# Altium schematic sheet HYDRA_V4_POWER.SchDoc
size A2; SheetNumber: 1; SheetTotal: 11
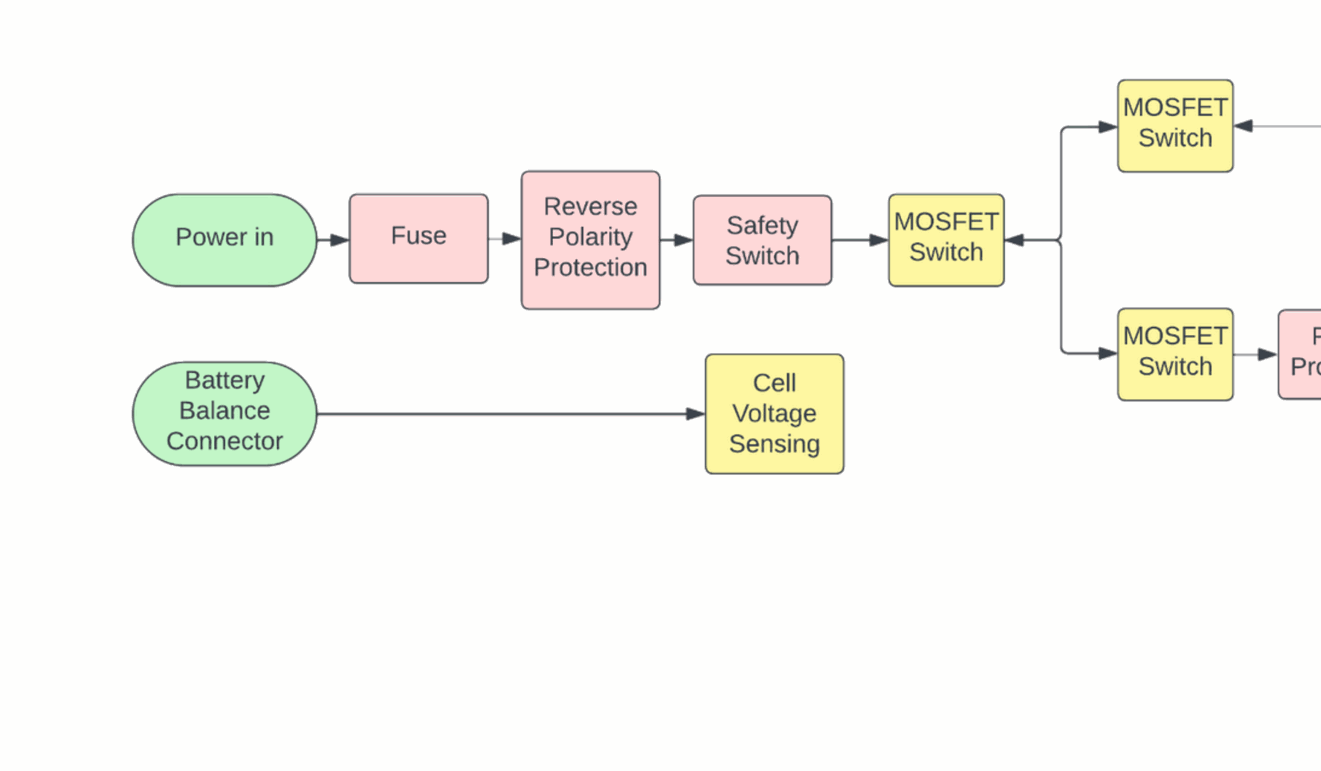
[diagram p0: HYDRA_V4_POWER.SchDoc, top left]
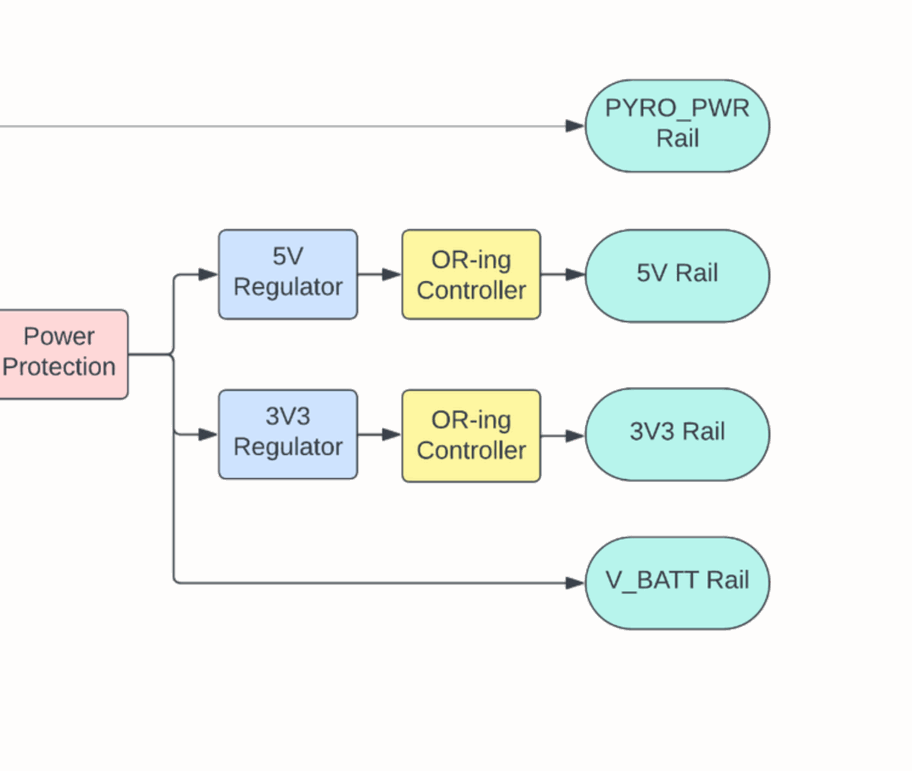
[diagram p1: HYDRA_V4_POWER.SchDoc, top right]
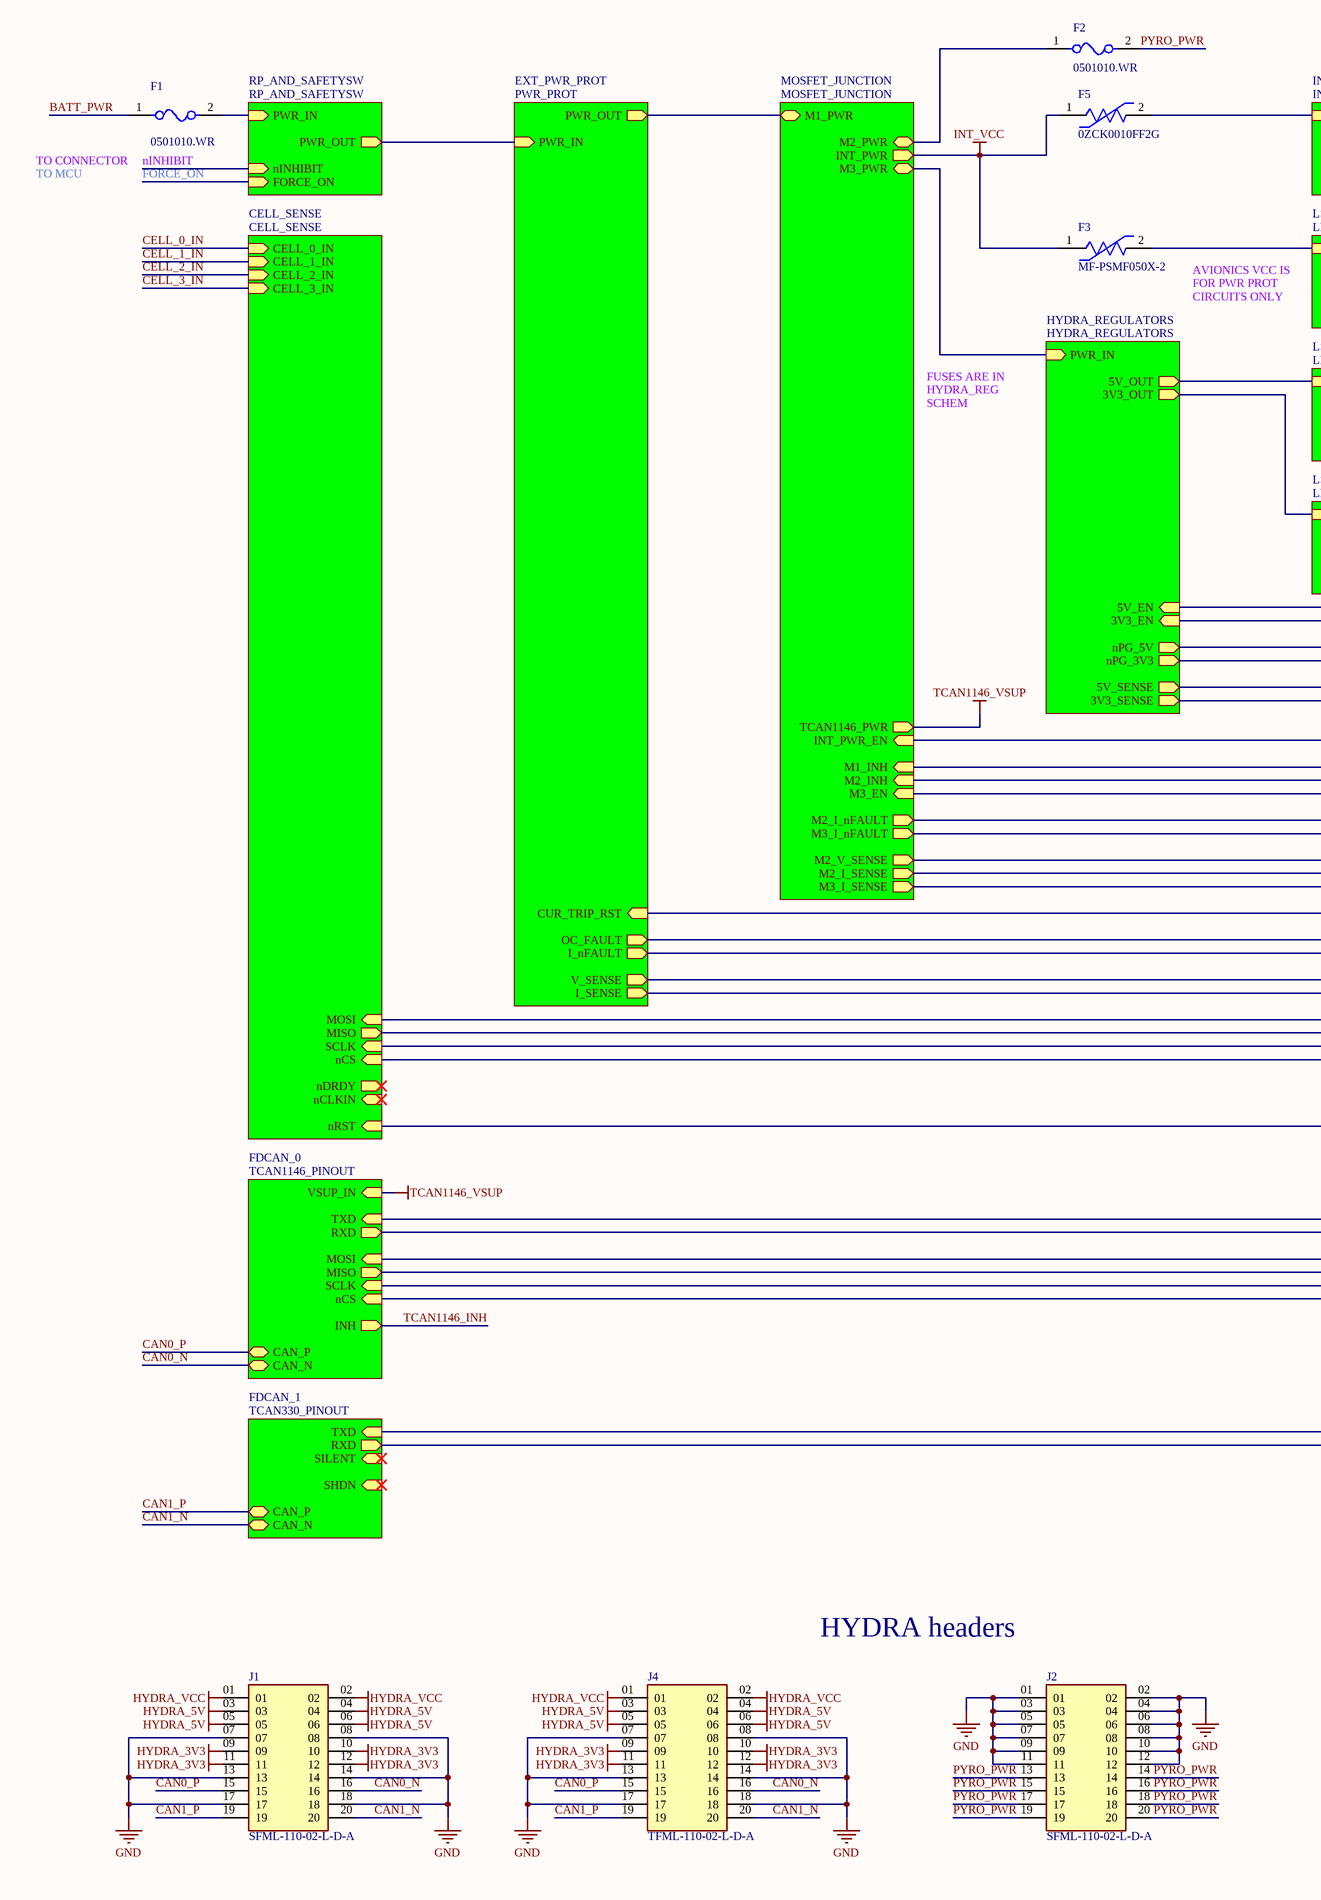
[diagram p2: HYDRA_V4_POWER.SchDoc, bottom left]
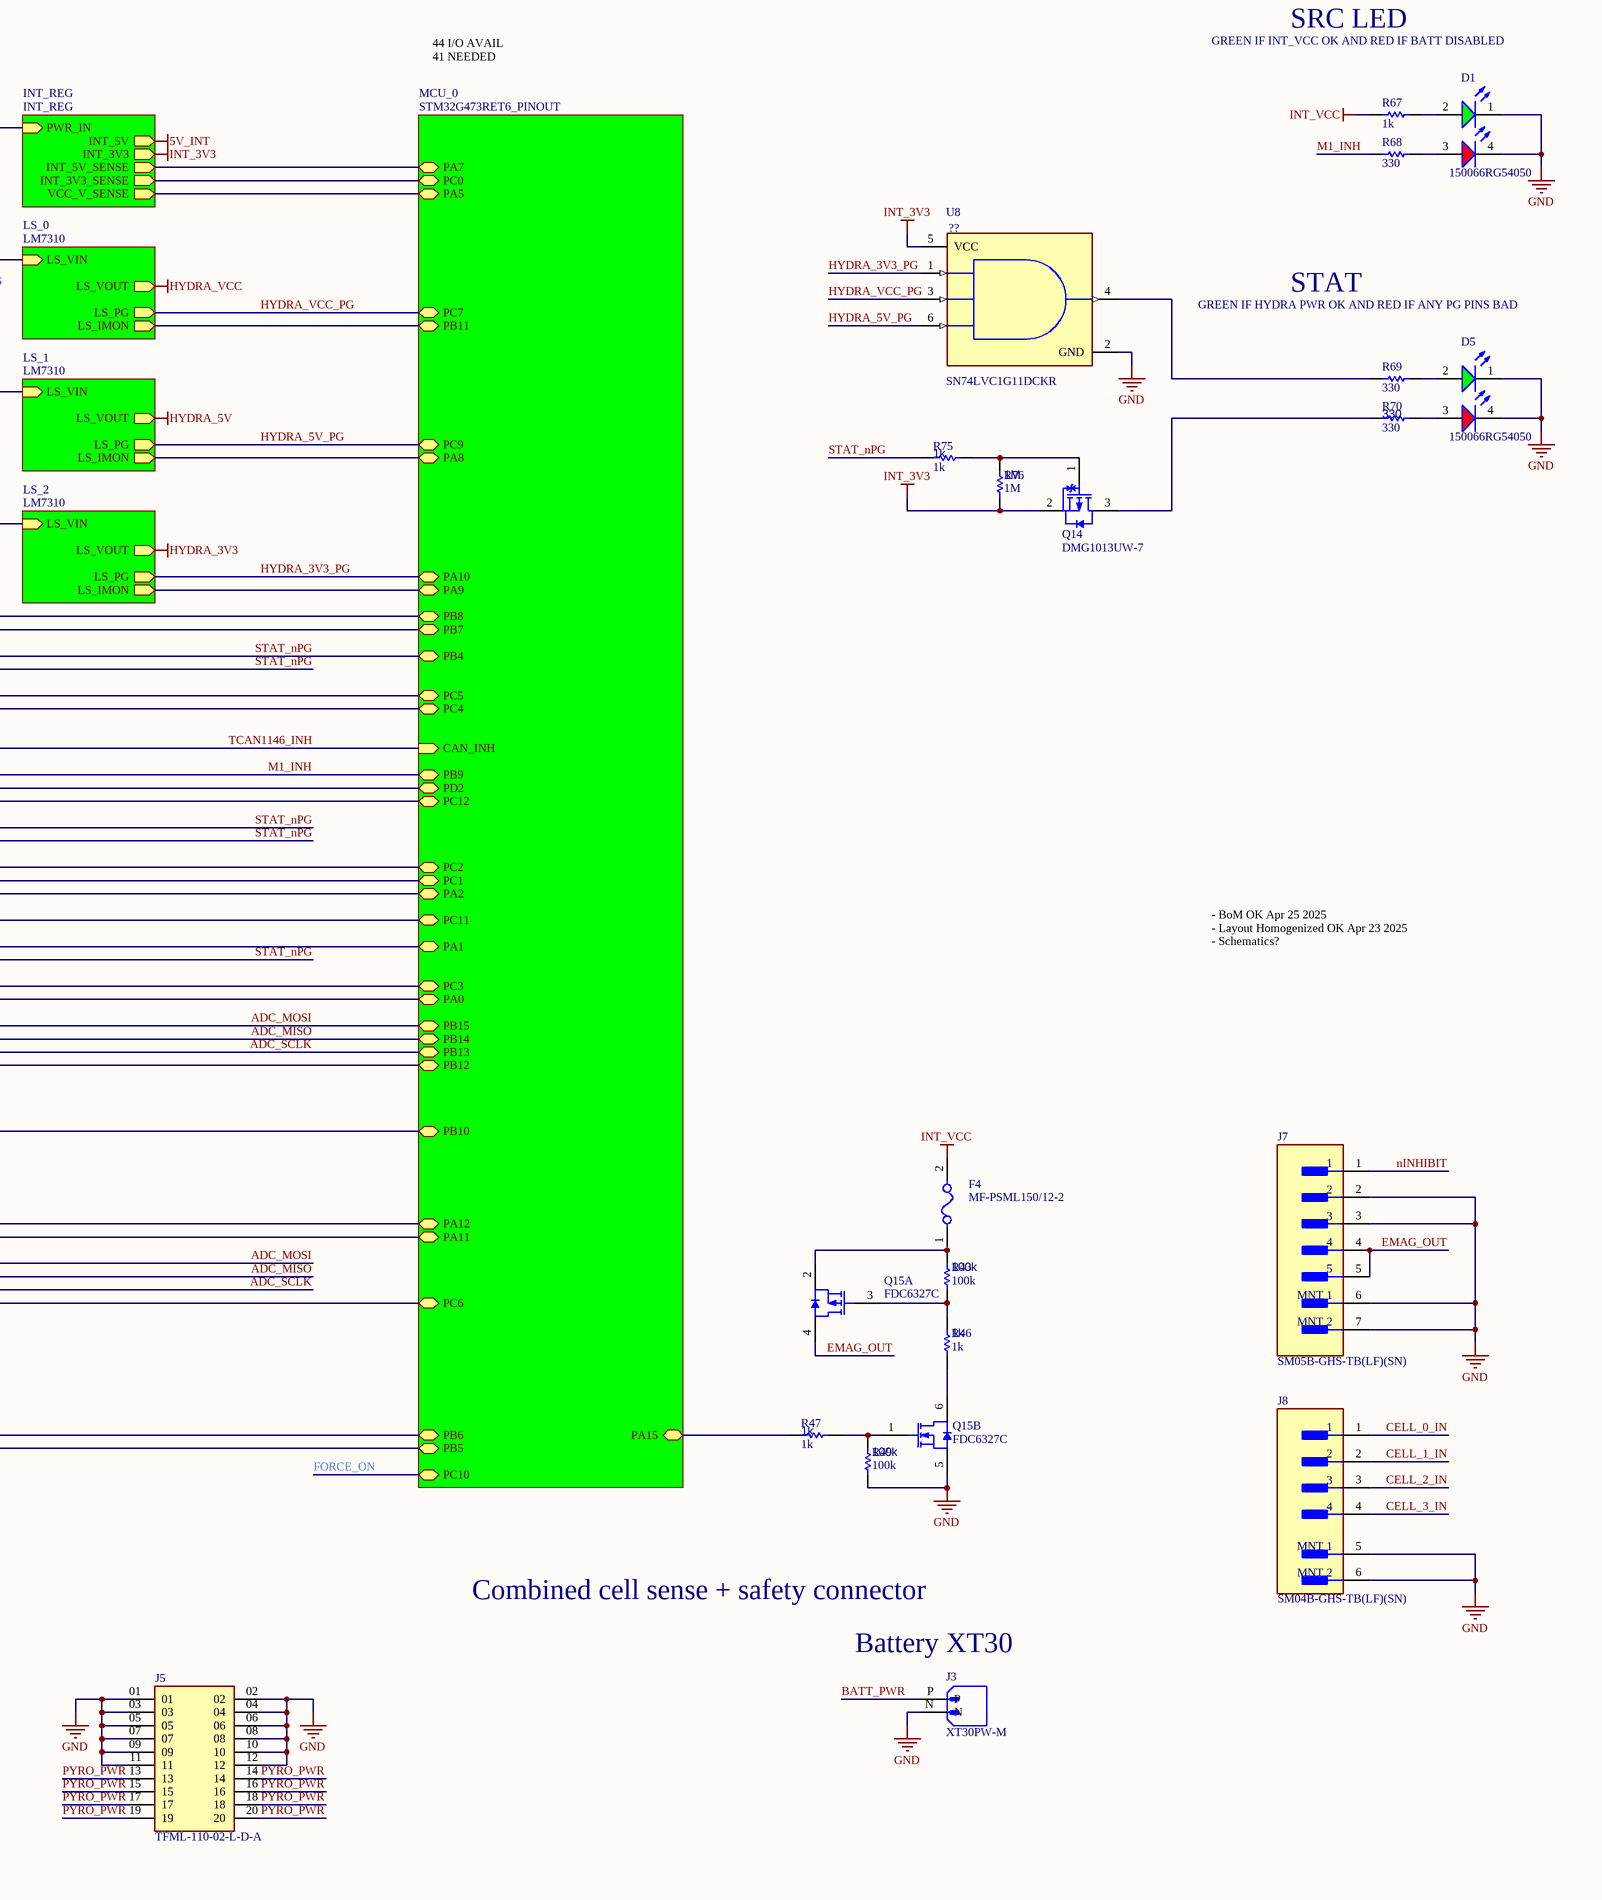
[diagram p3: HYDRA_V4_POWER.SchDoc, bottom right]

## Parts
D1  150066RG54050  [WL-SBCD_0606]
D5  150066RG54050  [WL-SBCD_0606]
F1  0501010.WR  [FP-0501-MFG]
F2  0501010.WR  [FP-0501-MFG]
F3  MF-PSMF050X-2  [FP-MF-PSMF-MFG]
F4  MF-PSML150/12-2  [FP-0805L010-MFG]
F5  0ZCK0010FF2G  [FP-0ZCK0010FF2G-MFG]
J1  SFML-110-02-L-D-A  [SFML-110-02-L-D-A-Footprint-1]
J2  SFML-110-02-L-D-A  [SFML-110-02-L-D-A-Footprint-1]
J3  XT30PW-M  [XT30PW-M-Footprint-1]
J4  TFML-110-02-L-D-A  [TFML-110-02-L-D-A-Footprint-1]
J5  TFML-110-02-L-D-A  [TFML-110-02-L-D-A-Footprint-1]
J7  SM05B-GHS-TB(LF)(SN)  [FP-SM05B-GHS-TB_LF_SN-MFG]
J8  SM04B-GHS-TB(LF)(SN)  [FP-SM04B-GHS-TB_LF_SN-MFG]
Q14  DMG1013UW-7  [DIOD-SOT323-3_V]
Q15  FDC6327C  [FAIR-SOT23-6_V]  (parts A,B of 2)
R43  100k  [R0603B]
R46  1k  [R0603B]
R47  1k  [R0603B]
R49  100k  [R0603B]
R67  1k  [R0603B]
R68  330  [R0603B]
R69  330  [R0603B]
R70  330  [R0603B]
R75  1k  [R0603B]
R76  1M  [R0603B]
U8  SN74LVC1G11DCKR  [FP-DCK0006A-MFG]  (value not drawn)

## Sub-sheets
CELL_SENSE = CELL_SENSE: CELL_0_IN (in), CELL_1_IN (in), CELL_2_IN (in), CELL_3_IN (in), MOSI (in), MISO (out), SCLK (in), nCS (in), nRST (in), nDRDY (out), nCLKIN (in)
EXT_PWR_PROT = PWR_PROT: PWR_IN (in), PWR_OUT (out), V_SENSE (out), I_SENSE (out), CUR_TRIP_RST (in), OC_FAULT (out), I_nFAULT (out)
FDCAN_0 = TCAN1146_PINOUT: TXD (in), RXD (out), MOSI (in), MISO (out), SCLK (in), nCS (in), INH (out), CAN_P (bidir), CAN_N (bidir), VSUP_IN (in)
FDCAN_1 = TCAN330_PINOUT: TXD (in), RXD (out), SHDN (in), SILENT (in), CAN_P (bidir), CAN_N (bidir)
HYDRA_REGULATORS = HYDRA_REGULATORS: PWR_IN (in), 5V_OUT (out), 3V3_OUT (out), 5V_SENSE (out), 3V3_SENSE (out), 5V_EN (in), 3V3_EN (in), nPG_3V3 (out), nPG_5V (out)
INT_REG = INT_REG: PWR_IN (in), INT_3V3 (out), INT_3V3_SENSE (out), VCC_V_SENSE (out), INT_5V (out), INT_5V_SENSE (out)
LS_0 = LM7310: LS_VIN (in), LS_VOUT (out), LS_PG (out), LS_IMON (out)
LS_1 = LM7310: LS_VIN (in), LS_VOUT (out), LS_PG (out), LS_IMON (out)
LS_2 = LM7310: LS_VIN (in), LS_VOUT (out), LS_PG (out), LS_IMON (out)
MCU_0 = STM32G473RET6_PINOUT: CAN_INH (in), PB12 (bidir), PB13 (bidir), PB14 (bidir), PB15 (bidir), PA11 (bidir), PA12 (bidir), PB5 (bidir), PB6 (bidir), PC7 (bidir), PB11 (bidir), PC9 (bidir), PA8 (bidir), PA9 (bidir), PA10 (bidir), PC6 (bidir), PA5 (bidir), PC0 (bidir), PB7 (bidir), PB8 (bidir), PB4 (bidir), PC5 (bidir), PC4 (bidir), PB9 (bidir), PD2 (bidir), PC12 (bidir), PC3 (bidir), PC2 (bidir), PA1 (bidir), PC1 (bidir), PA0 (bidir), PB10 (bidir), PC11 (bidir), PA2 (bidir), PA15 (bidir), PC10 (bidir), PA7 (bidir)
MOSFET_JUNCTION = MOSFET_JUNCTION: M1_PWR (bidir), M2_PWR (bidir), M3_PWR (bidir), INT_PWR (out), M2_I_SENSE (out), M3_I_SENSE (out), M2_INH (in), M1_INH (in), M3_EN (in), INT_PWR_EN (in), TCAN1146_PWR (out), M2_V_SENSE (out), M2_I_nFAULT (out), M3_I_nFAULT (out)
RP_AND_SAFETYSW = RP_AND_SAFETYSW: PWR_IN (in), PWR_OUT (out), nINHIBIT (in), FORCE_ON (in)

## Nets
5V_INT: sheet INT_REG/INT_5V
GND: D1.1(K) D1.4(K) D5.1(K) D5.4(K) J1.07 J1.08 J1.13 J1.14 J1.17 J1.18 J2.01 J2.02 J2.03 J2.04 J2.05 J2.06 J2.07 J2.08 J2.09 J2.10 J2.11 J2.12 J3.N J4.07 J4.08 J4.13 J4.14 J4.17 J4.18 J5.01 J5.02 J5.03 J5.04 J5.05 J5.06 J5.07 J5.08 J5.09 J5.10 J5.11 J5.12 J7.2 J7.3 J7.6(MNT_1) J7.7(MNT_2) J8.5(MNT_1) J8.6(MNT_2) Q15.5(S) R49.2 U8.2(GND)
HYDRA_3V3: J1.09 J1.10 J1.11 J1.12 J4.09 J4.10 J4.11 J4.12 ; sheet LS_2/LS_VOUT
HYDRA_5V: J1.03 J1.04 J1.05 J1.06 J4.03 J4.04 J4.05 J4.06 ; sheet LS_1/LS_VOUT
HYDRA_VCC: J1.01 J1.02 J4.01 J4.02 ; sheet LS_0/LS_VOUT
INT_3V3: Q14.2(S) R76.2 U8.5(VCC) ; sheet INT_REG/INT_3V3
INT_VCC: F3.1 F4.2 F5.1 R67.2 ; sheet MOSFET_JUNCTION/INT_PWR
TCAN1146_VSUP: sheet MOSFET_JUNCTION/TCAN1146_PWR, sheet FDCAN_0/VSUP_IN
ADC_MISO: sheet MCU_0/PB14, sheet CELL_SENSE/MISO, sheet FDCAN_0/MISO
ADC_MOSI: sheet MCU_0/PB15, sheet CELL_SENSE/MOSI, sheet FDCAN_0/MOSI
ADC_SCLK: sheet MCU_0/PB13, sheet CELL_SENSE/SCLK, sheet FDCAN_0/SCLK
BATT_PWR: F1.1 J3.P
CAN0_N: J1.16 J4.16 ; sheet FDCAN_0/CAN_N
CAN0_P: J1.15 J4.15 ; sheet FDCAN_0/CAN_P
CAN1_N: J1.20 J4.20 ; sheet FDCAN_1/CAN_N
CAN1_P: J1.19 J4.19 ; sheet FDCAN_1/CAN_P
CELL_0_IN: J8.1 ; sheet CELL_SENSE/CELL_0_IN
CELL_1_IN: J8.2 ; sheet CELL_SENSE/CELL_1_IN
CELL_2_IN: J8.3 ; sheet CELL_SENSE/CELL_2_IN
CELL_3_IN: J8.4 ; sheet CELL_SENSE/CELL_3_IN
EMAG_OUT: J7.4 J7.5 Q15.4(D)
FORCE_ON: sheet MCU_0/PC10, sheet RP_AND_SAFETYSW/FORCE_ON
HYDRA_3V3_PG: U8.1(A) ; sheet MCU_0/PA10, sheet LS_2/LS_PG
HYDRA_5V_PG: U8.6(C) ; sheet MCU_0/PC9, sheet LS_1/LS_PG
HYDRA_VCC_PG: U8.3(B) ; sheet MCU_0/PC7, sheet LS_0/LS_PG
M1_INH: R68.2 ; sheet MCU_0/PB9, sheet MOSFET_JUNCTION/M1_INH
nINHIBIT: J7.1 ; sheet RP_AND_SAFETYSW/nINHIBIT
PYRO_PWR: F2.2 J2.13 J2.14 J2.15 J2.16 J2.17 J2.18 J2.19 J2.20 J5.13 J5.14 J5.15 J5.16 J5.17 J5.18 J5.19 J5.20
STAT_nPG: R75.2 ; sheet MCU_0/PB4, sheet EXT_PWR_PROT/I_nFAULT, sheet MOSFET_JUNCTION/M2_I_nFAULT, sheet MOSFET_JUNCTION/M3_I_nFAULT, sheet HYDRA_REGULATORS/nPG_3V3, sheet HYDRA_REGULATORS/nPG_5V
TCAN1146_INH: sheet MCU_0/CAN_INH, sheet MOSFET_JUNCTION/INT_PWR_EN, sheet FDCAN_0/INH
NetD1_2: D1.2(A) R67.1
NetD1_3: D1.3(A) R68.1
NetD5_2: D5.2(A) R69.1
NetD5_3: D5.3(A) R70.1
NetF1_2: F1.2 ; sheet RP_AND_SAFETYSW/PWR_IN
NetF2_1: F2.1 ; sheet MOSFET_JUNCTION/M2_PWR
NetF3_2: F3.2 ; sheet LS_0/LS_VIN
NetF4_1: F4.1 Q15.2(S) R43.2
NetF5_2: F5.2 ; sheet INT_REG/PWR_IN
NetQ14_1: Q14.1(G) R75.1 R76.1
NetQ14_3: Q14.3(D) R70.2
NetQ15_1: Q15.1(G) R47.1 R49.1
NetQ15_3: Q15.3(G) R43.1 R46.1
NetQ15_6: Q15.6(D) R46.2
NetR47_2: R47.2 ; sheet MCU_0/PA15
NetR69_2: R69.2 U8.4(Y)
(unnamed): sheet MCU_0/PB12, sheet CELL_SENSE/nCS
(unnamed): sheet MCU_0/PA11, sheet FDCAN_0/RXD
(unnamed): sheet MCU_0/PA12, sheet FDCAN_0/TXD
(unnamed): sheet MCU_0/PB5, sheet FDCAN_1/RXD
(unnamed): sheet MCU_0/PB6, sheet FDCAN_1/TXD
(unnamed): sheet MCU_0/PB11, sheet LS_0/LS_IMON
(unnamed): sheet MCU_0/PA8, sheet LS_1/LS_IMON
(unnamed): sheet MCU_0/PA9, sheet LS_2/LS_IMON
(unnamed): sheet MCU_0/PC6, sheet FDCAN_0/nCS
(unnamed): sheet MCU_0/PA5, sheet INT_REG/VCC_V_SENSE
(unnamed): sheet MCU_0/PC0, sheet INT_REG/INT_3V3_SENSE
(unnamed): sheet MCU_0/PB7, sheet HYDRA_REGULATORS/3V3_EN
(unnamed): sheet MCU_0/PB8, sheet HYDRA_REGULATORS/5V_EN
(unnamed): sheet MCU_0/PC5, sheet HYDRA_REGULATORS/5V_SENSE
(unnamed): sheet MCU_0/PC4, sheet HYDRA_REGULATORS/3V3_SENSE
(unnamed): sheet MCU_0/PD2, sheet MOSFET_JUNCTION/M2_INH
(unnamed): sheet MCU_0/PC12, sheet MOSFET_JUNCTION/M3_EN
(unnamed): sheet MCU_0/PC3, sheet EXT_PWR_PROT/V_SENSE
(unnamed): sheet MCU_0/PC2, sheet MOSFET_JUNCTION/M2_V_SENSE
(unnamed): sheet MCU_0/PA1, sheet EXT_PWR_PROT/OC_FAULT
(unnamed): sheet MCU_0/PC1, sheet MOSFET_JUNCTION/M2_I_SENSE
(unnamed): sheet MCU_0/PA0, sheet EXT_PWR_PROT/I_SENSE
(unnamed): sheet MCU_0/PB10, sheet CELL_SENSE/nRST
(unnamed): sheet MCU_0/PC11, sheet EXT_PWR_PROT/CUR_TRIP_RST
(unnamed): sheet MCU_0/PA2, sheet MOSFET_JUNCTION/M3_I_SENSE
(unnamed): sheet MCU_0/PA7, sheet INT_REG/INT_5V_SENSE
(unnamed): sheet EXT_PWR_PROT/PWR_IN, sheet RP_AND_SAFETYSW/PWR_OUT
(unnamed): sheet EXT_PWR_PROT/PWR_OUT, sheet MOSFET_JUNCTION/M1_PWR
(unnamed): sheet MOSFET_JUNCTION/M3_PWR, sheet HYDRA_REGULATORS/PWR_IN
(unnamed): sheet HYDRA_REGULATORS/5V_OUT, sheet LS_1/LS_VIN
(unnamed): sheet HYDRA_REGULATORS/3V3_OUT, sheet LS_2/LS_VIN

## Notes on the sheet
- GREEN IF INT_VCC OK AND RED IF BATT DISABLED
- SRC LED
- 44 I/O AVAIL
  41 NEEDED
- TO MCU
- TO CONNECTOR
- AVIONICS VCC IS FOR PWR PROT CIRCUITS ONLY
- GREEN IF HYDRA PWR OK AND RED IF ANY PG PINS BAD
- STAT
- FUSES ARE IN HYDRA_REG SCHEM
- - BoM OK Apr 25 2025
  - Layout Homogenized OK Apr 23 2025
  - Schematics?
- HYDRA headers
- Combined cell sense + safety connector
- (near J3) Battery XT30
- (in symbol CMP-0859-00482-4) ??

## Library data of the parts
D1 D5 = CMP-004-00040-2: Led, Red/Grn, 180Mcd/230Mcd, 624Nm/525Nm Rohs Compliant: Yes; Source: rgled.SchLib; Component Type: Standard; Design Item ID: CMP-004-00034-2; Pins: 4
F1 F2 = CMP-08605-000084-1: FUSE BOARD MOUNT 10A 32VDC 1206; Working Voltage: 32V; Approvals: UL; Fuse Type: Board Mount (Cartridge Style Excluded); DC Cold Resistance: 4.27mR; Depth: 1.63mm; Housing Material: Ceramic; Max Operating Temperature: 150°C; Voltage Rating (DC): 32V; Width: 1.63mm; Height: 0.033inch; Current Rating: 10A; Composition: Ceramic; Lead Free: Lead Free; Case Code (Metric): 3216; Min Operating Temperature: -55°C; Packaging: Tape and Reel; Mount: Surface Mount; Case/Package: 1206; Case Code (Imperial): 1206; Package Quantity: 3000; Length: 3.2mm
F3 = CMP-07400-000013-1: PTC RESET FUSE 6V 500MA 0805; Manufacturer: Bourns Inc.; Trip Current: 1A; Trip Time: 0.1s; Value: 0.15-0.9Ω; Hold Current: 0.5A; Current Rating: 40A; Category: Fuse; Temperature: -40°C to +85°C; ComponentLink2Description: Datasheet; Manufacturer Part Number: MF-PSMF050X-2; Temperature Range High: +85°C; Package: MF-PSMF; Device Class L1: Circuit Protection; Lead Free: Yes; ComponentLink2URL: https://www.bourns.com/docs/product-datasheets/mfpsmf.pdf?sfvrsn=9c05cafe_24; Ambient Temperature Range Low: -40°C; Mouser Description: Resettable Fuses - PPTC .50A 6V 0.15ohm Hold .5 Trip 1; Resistance: 0.15-0.9Ω; Automotive: Yes; Ambient Temperature Range High: +85°C; Device Class L2: PTC Resettable Fuses; Temperature Range Low: -40°C; Device Class L3: unset; Octopart: https://octopart.com/mf-psmf050x-2-bourns-7483438; Digikey Description: PTC RESET FUSE 6V 500MA 0805; Height: 0.85mm; RoHS: TRUE; Voltage Rating: 6V
F4 = CMP-00227-00673855-1: NexarPartId: 673855; Minimum Resistance Initial (Rmin): 1Ω; Maximum Resistance 1 Hour (R1max): 6Ω; Max Current Rating: 100A; Power Dissipation: 500mW; Working Voltage: 15V; Time to Trip: 1.5s; Hold Current: 100mA; Trip Current: 300mA; Approvals: TUV, cULus; Min Operating Temperature: -40°C; Case Code (Imperial): 0805; Termination: SMD/SMT; Height: 1mm; Resistance: 6Ω; Case Code (Metric): 2012; Lifecycle Status: Production; Operating Supply Voltage: 15V; Mount: Surface Mount; Voltage Rating: 15V; RoHS: Compliant; Width: 1.5mm; Length: 2.2mm; Voltage Rating (DC): 15V; Ambient Temperature Range High: 85°C; Max Power Dissipation: 500mW; Lead Free: Lead Free; Max Operating Temperature: 85°C; Current Rating: 100A; Terminal Material: Copper; Packaging: Cut Tape; REACH SVHC: No SVHC; Max Voltage Rating (DC): 15V; Case/Package: 0805
F5 = CMP-16043-000017-1: PTC RESET FUSE 15V 100MA 0805; Max Current Rating: 100A; Trip Current: 300mA; Time to Trip: 1.5s; Lead Free: Lead Free; Case/Package: 0805; Package Quantity: 1; Hold Current: 100mA; Case Code (Metric): 2012; Packaging: Tape and Reel; Case Code (Imperial): 0805; RoHS Compliant: Yes
J1 J2 = CMP-002-00043-1: Board Connector, 20 Contact(s), 2 Row(s), Female, Straight, 0.05 inch Pitch, Surface Mount Terminal, Locking, Black Insulator, Socket; RoHS Compliant: Yes; Connector Type: BOARD CONNECTOR; Mounting Technology: Board
J3 = CMP-002-00064-1
J4 J5 = CMP-002-00042-3: Board Connector, 20 Contact(s), 2 Row(s), Male, Straight, Surface Mount Terminal; Connector Type: BOARD CONNECTOR; Mounting Technology: Board; RoHS Compliant: Yes
J7 = CMP-002-00081-1: Connector Header, GH Series, 5 Position, 1.25mm, Surface Mount, Right Angle, Tin, Natural
J8 = CMP-002-00080-1: Conn Shrouded Header HDR 4 POS 1.25mm Solder RA SMD Reel
Q14 = CMP-2000-06170-1: P-Channel Enhancement Mode MOSFET, 310 mW, 20 V, -55 to 150 degC, 3-Pin SOT-323, RoHS, Tape and Reel; Manufacturer: Diodes Inc; Qg Gate Charge: 0.622nC; Drain-Source On Resistance-Max: 750mO; Rated Power Dissipation: 310mW; Drain-to-Source Voltage [Vdss]: 20V; Package Reference: SOT323; Datasheet Version: Rev. 3-2, 09/2013; Package Description: 3-Pin Small Outline Transistor, Body 2 x 1.25 mm, Pitch 0.65 mm; Mounting Technology: SurfaceMount; Manufacturer URL: http://www.diodes.com/; Datasheet URL: http://www.diodes.com/_files/datasheets/ds31861.pdf; Channel Type: P-Channel
Q15 = CMP-2000-04939-1: Dual N & P-Channel 2.5 V Specified PowerTrench(TM) MOSFET, -55 to 150 degC, 6-Pin SOT-23, RoHS, Tape and Reel; Manufacturer: Fairchild; Typical Rise Time: 9@NChannel; Rad Hard: No; Maximum Drain Source Voltage: 20V; Typical Fall Time: 3@NChannel; Typical Turn-On Delay Time: 5@NChannel; Maximum Continuous Drain Current: 2.7@NChannel; Typical Turn-Off Delay Time: 12@NChannel; RDS-on: 80@4.5V@NChannel; Channel Mode: Enhancement; Maximum Gate Source Voltage: ±8V; Package Version: Rev. 5, 05/2015; Operating Temperature: -55to150degC; Packaging: Tape&Reel; Package Reference: SOT23-6; Package URL: https://www.fairchildsemi.com/package-drawings/MA/MA06A.pdf; Package Description: 6-Pin Small Outline Transistor, Body 2.9 x 1.6 mm, Pitch 0.95 mm; Manufacturer URL: https://www.fairchildsemi.com/; Channel Type: N; Datasheet Version: Rev. E, 07/2000; Package: 6SuperSOT; Datasheet URL: https://www.fairchildsemi.com/datasheets/FD/FDC6327C.pdf; Mounting: SurfaceMount; Category: MOSFET
R43 R46 R47 R49 R67-R70 R75 R76 = CMP-009-00002-14: Resistor
  R43 R49: Value: 100k
  R46 R47 R67 R75: Value: 1k
  R68-R70: Value: 330
  R76: Value: 1M
U8 = CMP-0859-00482-4: IC GATE AND 1CH 3-INP SC70-6; Manufacturer: Texas Instruments; Number Of Circuits: 1; Min Supply Voltage: 1.5V; Max Supply Voltage: 5.5V; Max Junction Temp: +150°C; Standoff Height: 0mm; Number Of Inputs: 3; Propagation Delay: 4.6ns; Logic Function Desc: Non-Inverting; Nominal Supply Current: 10uA; Lead Free: Yes; Digikey Description: IC GATE AND 1CH 3-INP SC70-6; Device Class L1: Integrated Circuits (ICs); Temperature Range High: +125°C; Manufacturer Part Number: SN74LVC1G11DCKR; Number Of Outputs: 1; Temperature Range Low: -40°C; Device Class L3: Logic Gates; RoHS: TRUE; Temperature: -40°C to +125°C; Ambient Temperature Range High: +125°C; Mouser Description: Logic Single 3-Input And Gate, 3.5ns, Sc70-6, Full Reel; Device Class L2: Logic ICs; Category: IC; ComponentLink2URL: http://www.ti.com/lit/ds/symlink/sn74lvc1g11.pdf; ComponentLink2Description: Datasheet; Automotive: No; Package: DCK0006A; Ambient Temperature Range Low: -40°C; Height: 1.1mm; Octopart: https://octopart.com/sn74lvc1g11dckr-texas+instruments-464959